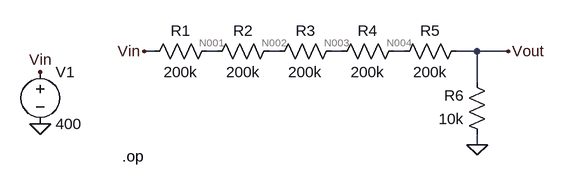
[diagram p0: schematic ResistorDividerStepDown.asc]
ResistorDividerStepDown.asc, the LTspice schematic file:
Version 4
SHEET 1 880 680
WIRE -336 128 -352 128
WIRE -240 128 -256 128
WIRE -144 128 -160 128
WIRE -48 128 -64 128
WIRE 48 128 32 128
WIRE 160 128 128 128
WIRE 208 128 160 128
WIRE 160 176 160 128
WIRE 160 272 160 256
FLAG 160 272 0
FLAG 208 128 Vout
FLAG -352 128 Vin
FLAG -512 160 Vin
FLAG -512 240 0
SYMBOL res -240 112 R90
WINDOW 0 0 56 VBottom 2
WINDOW 3 32 56 VTop 2
SYMATTR InstName R1
SYMATTR Value 200k
SYMBOL res -144 112 R90
WINDOW 0 0 56 VBottom 2
WINDOW 3 32 56 VTop 2
SYMATTR InstName R2
SYMATTR Value 200k
SYMBOL res -48 112 R90
WINDOW 0 0 56 VBottom 2
WINDOW 3 32 56 VTop 2
SYMATTR InstName R3
SYMATTR Value 200k
SYMBOL res 48 112 R90
WINDOW 0 0 56 VBottom 2
WINDOW 3 32 56 VTop 2
SYMATTR InstName R4
SYMATTR Value 200k
SYMBOL res 144 112 R90
WINDOW 0 0 56 VBottom 2
WINDOW 3 32 56 VTop 2
SYMATTR InstName R5
SYMATTR Value 200k
SYMBOL res 176 272 R180
WINDOW 0 36 76 Left 2
WINDOW 3 36 40 Left 2
SYMATTR InstName R6
SYMATTR Value 10k
SYMBOL voltage -512 144 R0
WINDOW 123 0 0 Left 0
WINDOW 39 0 0 Left 0
SYMATTR InstName V1
SYMATTR Value 400
TEXT -386 290 Left 2 !.op

The netlist it stands for:
* ResistorDividerStepDown.asc
R1 N001 Vin 200k
R2 N002 N001 200k
R3 N003 N002 200k
R4 N004 N003 200k
R5 Vout N004 200k
R6 0 Vout 10k
V1 Vin 0 400
.op
.backanno
.end

* Results of the author's LTspice run, read from the files saved beside the schematic
* Operating Point:
*   V(n001) = 320.8 V
*   V(vin) = 400 V
*   V(n002) = 241.6 V
*   V(n003) = 162.4 V
*   V(n004) = 83.17 V
*   V(vout) = 3.96 V
*   I(R6) = -396 µA
*   I(R5) = -396 µA
*   I(R4) = -396 µA
*   I(R3) = -396 µA
*   I(R2) = -396 µA
*   I(R1) = -396 µA
*   I(V1) = -396 µA